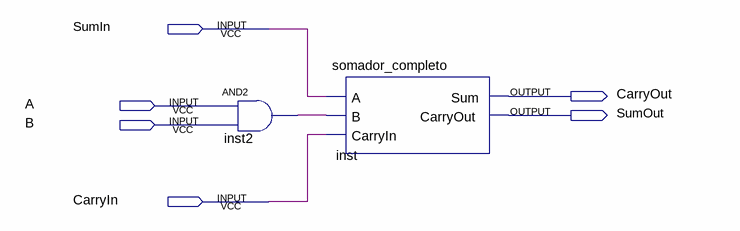
[diagram p0: schematic sheet]
// Quartus schematic multiplicador-completo.bdf as structural Verilog: 2 symbols, 6 pins
module \multiplicador-completo  (
  input  SumIn,
  input  A,
  input  B,
  input  CarryIn,
  output CarryOut,
  output SumOut
);

  wire inst2_out;

  and inst2 (inst2_out, A, B);
  somador_completo inst (.A(SumIn), .B(inst2_out), .CarryIn(CarryIn), .Sum(CarryOut), .CarryOut(SumOut));
endmodule
